# EAGLE board Replicape_B4 (EAGLE 7.7.0), part 1 of 2
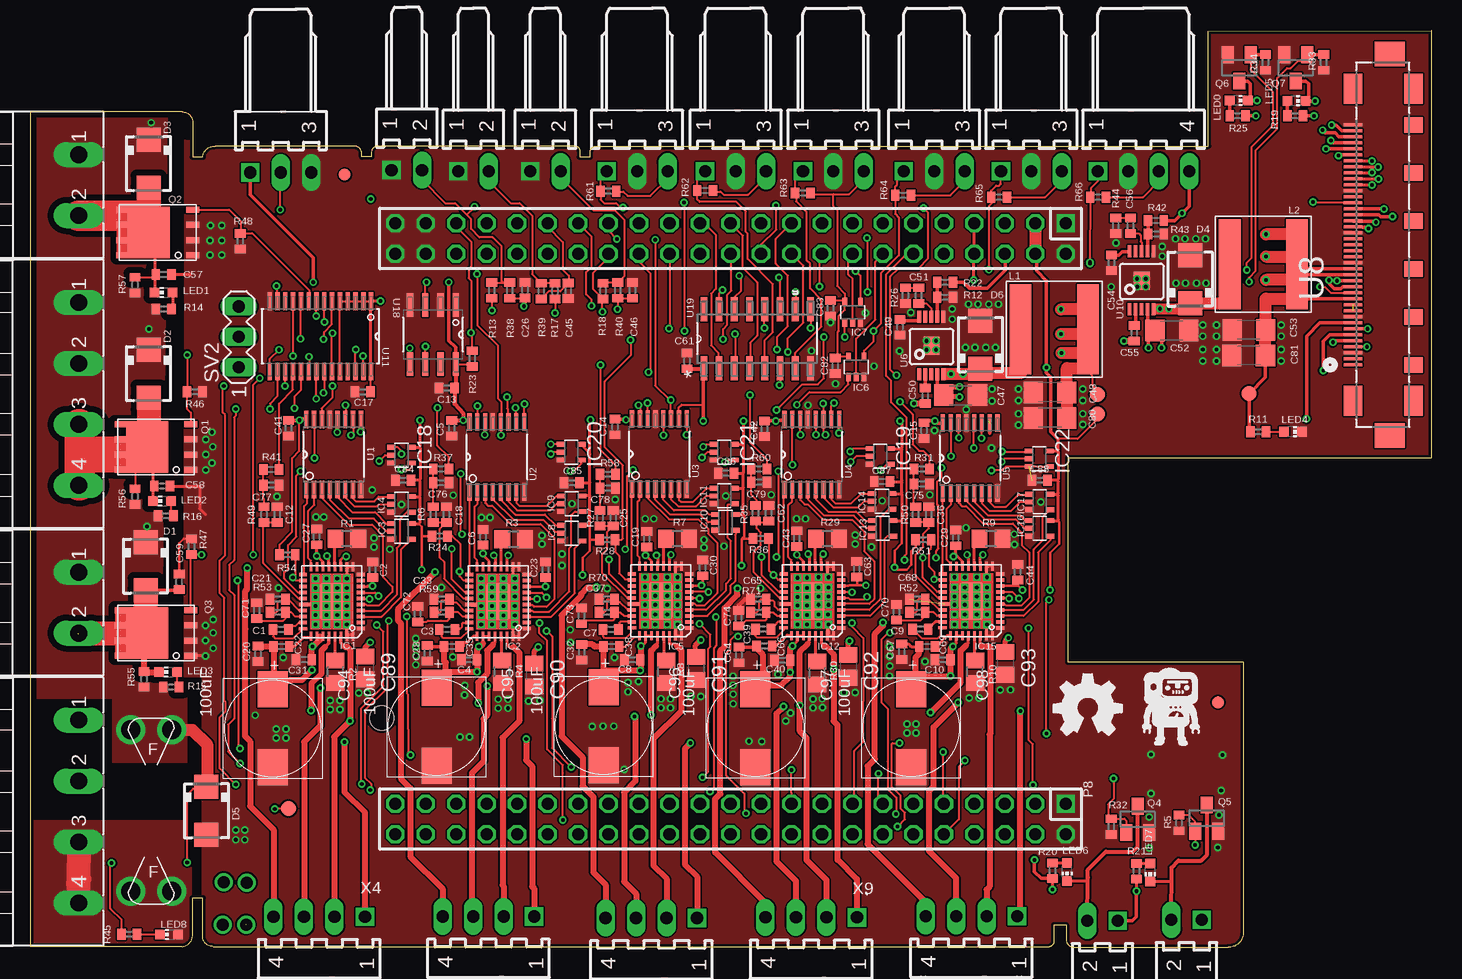
[diagram p3: board, top side]
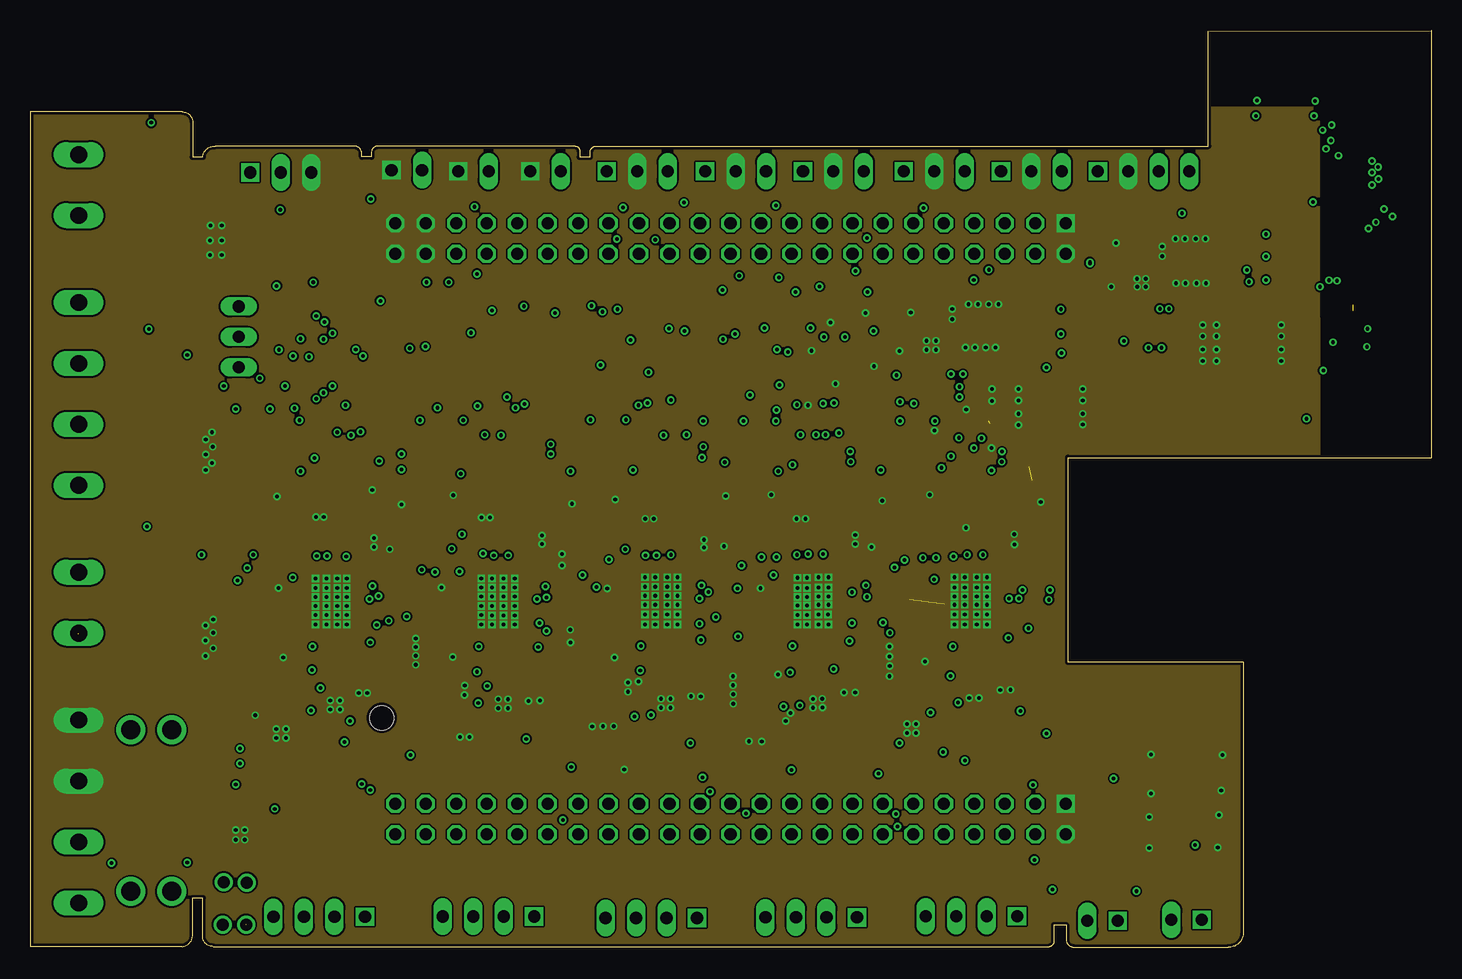
[diagram p4: board, inner layer GND]
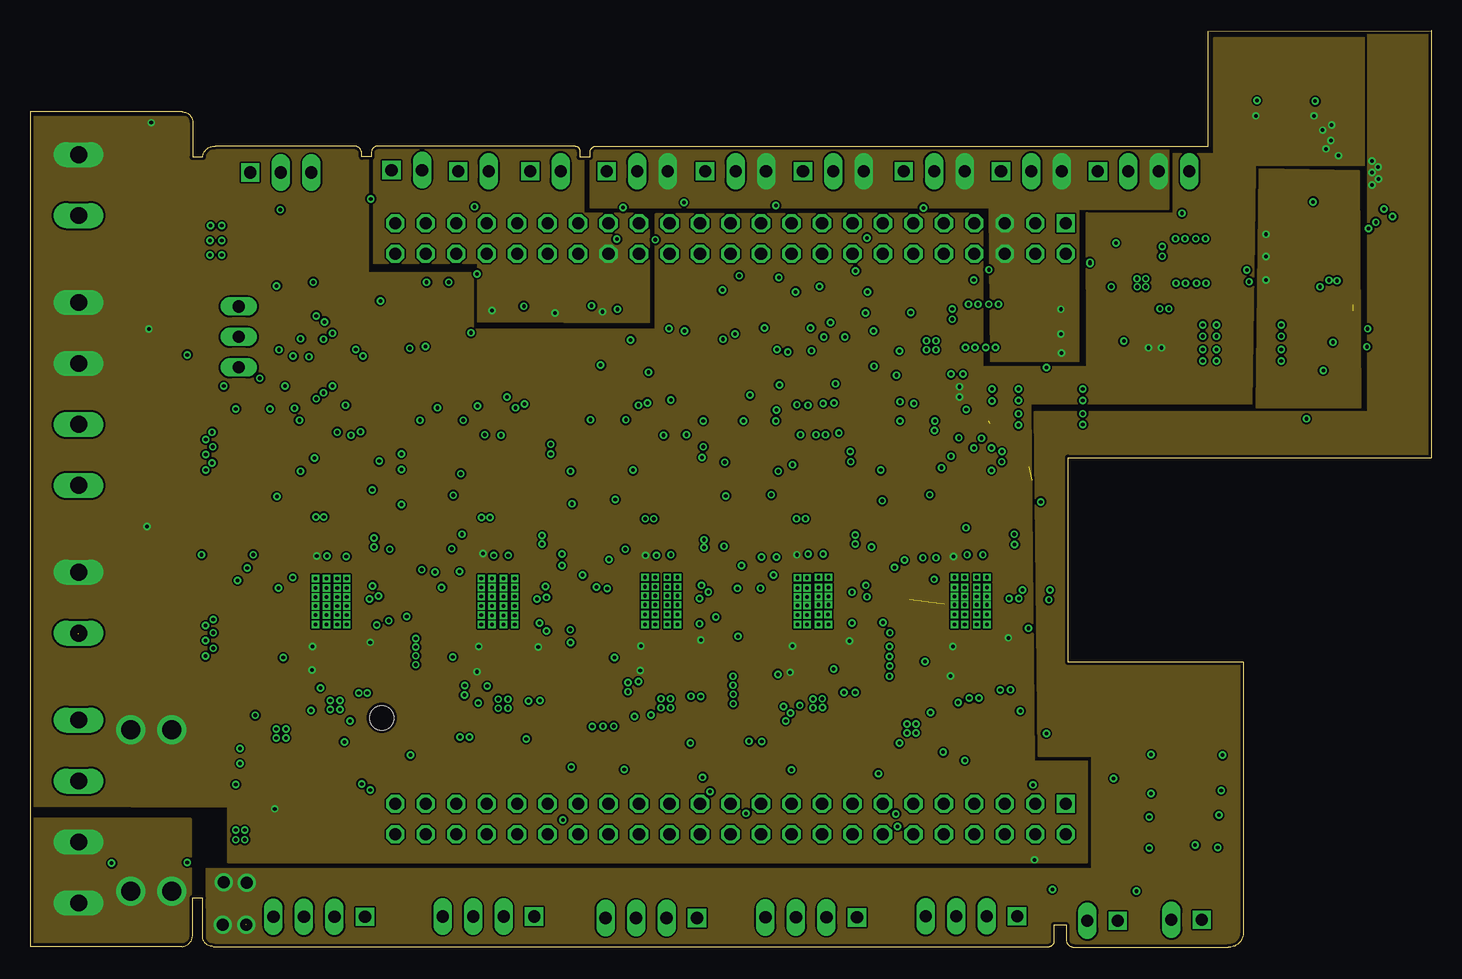
[diagram p5: board, inner layer VCC]
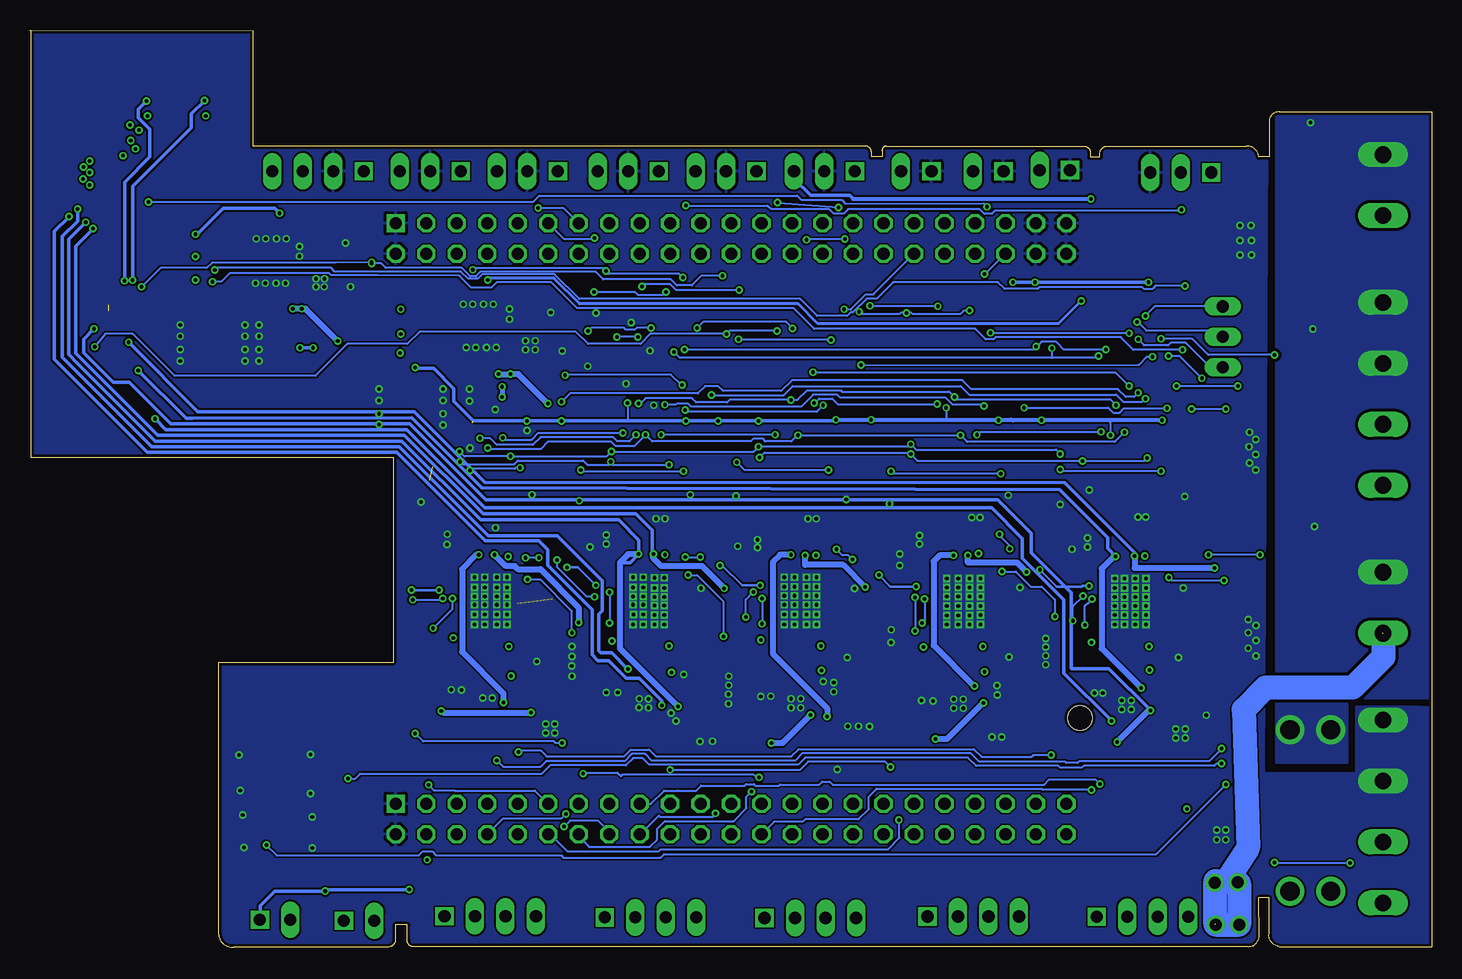
[diagram p6: board, bottom side, seen from below]

Size 116.8 x 76.43 mm. Coordinates in mm from the lower left corner, seen from the top.
Outline: 116.75,76.43 116.75,40.8 86.5,40.8 86.5,23.75 101.1,23.75 101.1,1.1 arc-90 99.85,0 86.95,0 arc-90 86.35,0.65 86.35,1.85 85.35,1.85 85.35,0.6 arc-90 84.95,0.05 15.28,0.05 arc-90 14.38,0.9 14.4,4.1 13.55,4.1 13.55,1.1 arc-90 12.7,0.05 0,0.05 0,69.6 12.7,69.6 arc-90 13.55,68.8 13.55,65.85 14.4,65.85 arc-90 15.45,66.75 27.05,66.75 arc-90 27.65,66.1 27.65,65.85 28.45,65.85 28.45,66.25 arc-90 29,66.75 45.45,66.75 arc-90 45.8,66.35 45.8,65.85 46.67,65.85 46.67,66.2 arc-90 47.17,66.75 98.2,66.75 98.2,76.33 116.8,76.35 116.8,76.4
Copper layers (1*2*3*16): Top 0.035mm / dielectric 0.2mm / GND 0.035mm / dielectric 1.1mm / VCC 0.035mm / dielectric 0.2mm / Bottom 0.035mm
Design rules "default *": minimum track width 0.003809375mm, minimum drill 0.3mm, track to track 6mil, track to pad 6mil, pad to pad 6mil, via to via 6mil, smd to smd 0mil, copper to edge 10mil, drill to drill 10mil, minimum pad ring 10mil, minimum via ring 6mil, stop-mask expansion 2mil, vias tented up to drill 100mil, thermal gap 10mil
Net classes: 1 power: width 1.27 mm
Holes 2 mm at 29.3,19.1

## Footprints (pad centres in the part's own frame; a part is rotated, then mirrored left to right if it is on the bottom)
B1,27 = smd 1.27 x 1.27: TP 0,0
C0402 = smd 0.7 x 0.9: 1 -0.65,0; 2 0.65,0
C1206 = smd 1.6 x 1.8: 1 -1.4,0; 2 1.4,0
C0805 = smd 1.3 x 1.5: 1 -0.95,0; 2 0.95,0
RHS1V10MCN1GS = smd 3 x 2.5: + -3.25,0; - 3.25,0
SMA = smd 2 x 2: A 2,0; C -2,0
3557 = drill 1.6: P$1 -6.73,1.7; P$2 -6.73,-1.7; P$3 6.73,-1.7; P$4 6.73,1.7
QFN36-PAD = smd 0.7 x 0.25: 1 -2.4,2.25; 2 -2.4,1.75; 3 -2.4,1.25; 4 -2.4,0.75; 5 -2.4,0.25; 6 -2.4,-0.25; 7 -2.4,-0.75; 8 -2.4,-1.25; 9 -2.4,-1.75; 10 -2.4,-2.25; 19 2.4,-2.25; 20 2.4,-1.75; 21 2.4,-1.25; 22 2.4,-0.75; 23 2.4,-0.25; 25 2.4,0.75; 26 2.4,1.25; 27 2.4,1.75; 28 2.4,2.25 | smd 0.25 x 0.7: 11 -1.75,-2.9; 13 -0.75,-2.9; 14 -0.25,-2.9; 15 0.25,-2.9; 16 0.75,-2.9; 17 1.25,-2.9; 18 1.75,-2.9; 29 1.75,2.9; 30 1.25,2.9; 31 0.75,2.9; 32 0.25,2.9; 33 -0.25,2.9; 34 -0.75,2.9; 36 -1.75,2.9 | smd 0.25 x 1: 12 -1.25,-2.75; 35 -1.25,2.75 | smd 1 x 0.25: 24 2.25,0.25 | smd 2 x 3: TP 0,0
SC70-5 = smd 0.4 x 0.7: 1 -0.65,-0.85; 2 0,-0.85; 3 0.65,-0.85; 4 0.65,0.85; 5 -0.65,0.85
FIDUCIAL-1X2.5 = smd 1 x 1: 1 0,0
NR8040T330 = smd 1.8 x 7.5: P$1 2.8,0; P$2 -2.8,0
CHIP-LED0603 = smd 0.8 x 0.8: A 0,-0.75; C 0,0.75
DIL-100-2X23 = drill 1.016 square: 1 -27.94,-1.27 | drill 1.016 octagon: 2 -27.94,1.27; 3 -25.4,-1.27; 4 -25.4,1.27; 5 -22.86,-1.27; 6 -22.86,1.27; 7 -20.32,-1.27; 8 -20.32,1.27; 9 -17.78,-1.27; 10 -17.78,1.27; 11 -15.24,-1.27; 12 -15.24,1.27; 13 -12.7,-1.27; 14 -12.7,1.27; 15 -10.16,-1.27; 16 -10.16,1.27; 17 -7.62,-1.27; 18 -7.62,1.27; 19 -5.08,-1.27; 20 -5.08,1.27; 21 -2.54,-1.27; 22 -2.54,1.27; 23 0,-1.27; 24 0,1.27; 25 2.54,-1.27; 26 2.54,1.27; 27 5.08,-1.27; 28 5.08,1.27; 29 7.62,-1.27; 30 7.62,1.27; 31 10.16,-1.27; 32 10.16,1.27; 33 12.7,-1.27; 34 12.7,1.27; 35 15.24,-1.27; 36 15.24,1.27; 37 17.78,-1.27; 38 17.78,1.27; 39 20.32,-1.27; 40 20.32,1.27; 41 22.86,-1.27; 42 22.86,1.27; 43 25.4,-1.27; 44 25.4,1.27; 45 27.94,-1.27; 46 27.94,1.27
8-DFN-EP-(5X6) = smd 1.1 x 0.5: 1 -2.9,1.905; 2 -2.9,0.635; 3 -2.9,-0.635; 4 -2.9,-1.905; 5 2.9,-1.905; 6 2.9,-0.635; 7 2.9,0.635; 8 2.9,1.905 | smd 3.5 x 4.3: TH 0.75,0
SOT23 = smd 1 x 1.4: 1 -0.95,-1.1; 2 0.95,-1.1; 3 0,1.1
R0805 = smd 1.3 x 1.5: 1 -0.95,0; 2 0.95,0
R0402 = smd 0.7 x 0.9: 1 -0.65,0; 2 0.65,0
MA03-1 = drill 1.016 long: 1 -2.54,0; 2 0,0; 3 2.54,0
SOP65P640X120-16N = smd 1.473 x 0.356: 1 -2.921,2.286; 2 -2.921,1.626; 3 -2.921,0.965; 4 -2.921,0.33; 5 -2.921,-0.33; 6 -2.921,-0.965; 7 -2.921,-1.626; 8 -2.921,-2.286; 9 2.921,-2.286; 10 2.921,-1.626; 11 2.921,-0.965; 12 2.921,-0.33; 13 2.921,0.33; 14 2.921,0.965; 15 2.921,1.626; 16 2.921,2.286
MSOP10 = smd 0.3 x 1: 1 -1,-2.4; 2 -0.5,-2.4; 3 0.005,-2.4; 4 0.5,-2.4; 5 1,-2.4; 6 1,2.4; 7 0.5,2.4; 8 0.005,2.4; 9 -0.5,2.4; 10 -1,2.4 | smd 1.3 x 1.5: EP 0.02,-0.04
JAE_FI-RE41S-HF = smd 0.254 x 1.549: 1 0,0; 2 0.508,0; 3 0.991,0; 4 1.499,0; 5 2.007,0; 6 2.489,0; 7 2.997,0; 8 3.505,0; 9 3.988,0; 10 4.496,0; 11 5.004,0; 12 5.512,0; 13 5.994,0; 14 6.502,0; 15 7.01,0; 16 7.493,0; 17 8.001,0; 18 8.509,0; 19 8.992,0; 20 9.5,0; 21 10.008,0; 22 10.49,0; 23 10.998,0; 24 11.506,0; 25 11.989,0; 26 12.497,0; 27 13.005,0; 28 13.487,0; 29 13.995,0; 30 14.503,0; 31 15.011,0; 32 15.494,0; 33 16.002,0; 34 16.51,0; 35 16.993,0; 36 17.501,0; 37 18.009,0; 38 18.491,0; 39 18.999,0; 40 19.507,0; 41 19.99,0 | smd 2.489 x 1.549: 42 -2.997,0; 43 23.012,0; 46 -2.997,-5.029; 47 23.012,-5.029 | smd 2.057 x 2.489: 44 -5.893,-3.073; 45 25.908,-3.073 | smd 1.295 x 1.549: 48 0,-5.029; 49 19.99,-5.029; 50 3.988,-5.029; 51 16.002,-5.029; 52 8.001,-5.029; 53 11.989,-5.029
SOP65P640X110-28N = smd 1.473 x 0.356: 1 -2.921,4.216; 2 -2.921,3.581; 3 -2.921,2.921; 4 -2.921,2.286; 5 -2.921,1.626; 6 -2.921,0.965; 7 -2.921,0.33; 8 -2.921,-0.33; 9 -2.921,-0.965; 10 -2.921,-1.626; 11 -2.921,-2.286; 12 -2.921,-2.921; 13 -2.921,-3.581; 14 -2.921,-4.216; 15 2.921,-4.216; 16 2.921,-3.581; 17 2.921,-2.921; 18 2.921,-2.286; 19 2.921,-1.626; 20 2.921,-0.965; 21 2.921,-0.33; 22 2.921,0.33; 23 2.921,0.965; 24 2.921,1.626; 25 2.921,2.286; 26 2.921,2.921; 27 2.921,3.581; 28 2.921,4.216
SOIC127P600X175-8N = smd 1.981 x 0.533: 1 -2.464,1.905; 2 -2.464,0.635; 3 -2.464,-0.635; 4 -2.464,-1.905; 5 2.464,-1.905; 6 2.464,-0.635; 7 2.464,0.635; 8 2.464,1.905
SOIC127P600X175-16N = smd 1.981 x 0.559: 1 -2.464,4.445; 2 -2.464,3.175; 3 -2.464,1.905; 4 -2.464,0.635; 5 -2.464,-0.635; 6 -2.464,-1.905; 7 -2.464,-3.175; 8 -2.464,-4.445; 9 2.464,-4.445; 10 2.464,-3.175; 11 2.464,-1.905; 12 2.464,-0.635; 13 2.464,0.635; 14 2.464,1.905; 15 2.464,3.175; 16 2.464,4.445
7395-03 = drill 1.016 square: 1 2.54,0 | drill 1.016 long: 2 0,0; 3 -2.54,0
MSTBA4 = drill 1.397 long: 1 -7.62,5.08; 2 -2.54,5.08; 3 2.54,5.08; 4 7.62,5.08
MSTBA2 = drill 1.397 long: 1 -2.54,5.08; 2 2.54,5.08
7395-04 = drill 1.016 square: 1 3.81,0 | drill 1.016 long: 2 1.27,0; 3 -1.27,0; 4 -3.81,0
7395-02 = drill 1.016 square: 1 1.27,0 | drill 1.016 long: 2 -1.27,0

## Placement (x,y rotation side)
3.3V  TPB1,27  [B1,27]  88.95,44.43 0 top
5V  TPB1,27  [B1,27]  88.95,46.05 270 top
12..24V  TPB1,27  [B1,27]  21.55,11.55 90 top
12V  TPB1,27  [B1,27]  101.6,46.13 90 top
C1  22nF  [C0402]  20.89,26.48 0 top
C2  0.1uF  [C0402]  28.55,31.45 90 top
C3  22nF  [C0402]  34.75,26.48 0 top
C4  0.1uF  [C0402]  36.6,23.95 180 top
C5  0.1uF  [C0402]  35.15,43.25 270 top
C6  0.1uF  [C0402]  37.75,34.15 90 top
C7  22nF  [C0402]  48.4,26.48 0 top
C8  0.1uF  [C0402]  50.2,23.95 180 top
C9  22nF  [C0402]  74.2,26.5 0 top
C10  0.1uF  [C0402]  76.05,23.95 180 top
C12  4.7uF  [C0402]  20.6,36.05 90 top
C13  0.1uF  [C0402]  34.73,46.6 180 top
C14  0.1uF  [C0402]  48.75,43.35 270 top
C15  0.1uF  [C0402]  74.5,43.05 270 top
C17  0.1uF  [C0402]  27.73,46.27 180 top
C18  4.7uF  [C0402]  34.7,36.05 90 top
C19  0.1uF  [C0402]  51.4,34 90 top
C20  0.1uF  [C0402]  19,24.45 90 top
C21  4.7uF  [C0402]  20.65,29 0 top
C22  0.1uF  [C0402]  20.95,25.05 180 top
C23  0.1uF  [C0402]  42.95,31.45 90 top
C25  4.7uF  [C0402]  48.6,35.75 90 top
C26  4.7uF  [C0402]  41.25,54.75 90 top
C27  0.1uF  [C0402]  23.89,34.18 90 top
C28  0.1uF  [C0402]  33.1,24.5 90 top
C29  0.1uF  [C0402]  77.15,34.1 90 top
C30  0.1uF  [C0402]  56.05,31.6 90 top
C31  0.1uF  [C0402]  22.83,23.96 180 top
C32  0.1uF  [C0402]  45.98,24.58 90 top
C33  4.7uF  [C0402]  34.3,29 0 top
C35  0.1uF  [C0402]  35.15,25.05 180 top
C36  4.7uF  [C0402]  74.9,36.05 90 top
C37  4.7uF  [C0402]  48.05,29 0 top
C38  0.1uF  [C0402]  48.45,25.05 180 top
C39  22nF  [C0402]  61.1,26.5 0 top
C40  0.1uF  [C0402]  62.7,23.9 180 top
C41  0.1uF  [C0402]  21.55,43.25 270 top
C42  0.1uF  [C0402]  61.2,43.2 270 top
C43  0.1uF  [C0402]  63.9,34.05 90 top
C44  0.1uF  [C0402]  82.3,31.25 90 top
C45  4.7uF  [C0402]  44.85,54.7 270 top
C46  4.7uF  [C0402]  50.2,54.73 90 top
C47  10uF  [C1206]  77.55,46 0 top
C48  10uF  [C1206]  85,46.23 180 top
C49  10nF  [C0402]  72.5,51.65 270 top
C50  10nF  [C0402]  74.6,45.95 270 top
C51  1nF  [C0402]  74.05,54.3 90 top
C52  10uF  [C1206]  95.15,51.4 0 top
C53  10uF  [C1206]  101.58,51.43 180 top
C54  10nF  [C0402]  90.12,57.03 270 top
C55  10nF  [C0402]  92.03,51.15 270 top
C56  1nF  [C0402]  91.7,60.13 90 top
C57  4.7nF  [C0402]  11.12,56.05 0 top
C58  4.7nF  [C0402]  11,38.43 0 top
C59  4.7nF  [C0402]  12.43,30.45 90 top
C61  0.1uF  [C0402]  54.75,48.85 90 top
C62  4.7uF  [C0402]  61.55,36.15 90 top
C63  0.1uF  [C0402]  68.9,31.5 90 top
C64  0.1uF  [C0402]  59.08,24.35 90 top
C65  4.7uF  [C0402]  60.7,29 0 top
C66  0.1uF  [C0402]  61.2,25.1 180 top
C67  0.1uF  [C0402]  72.65,24.63 90 top
C68  4.7uF  [C0402]  73.95,29 0 top
C69  0.1uF  [C0402]  74.75,25.05 180 top
C70  0.1uF  [C0402]  72.2,27.9 90 top
C71  0.1uF  [C0402]  18.9,28.05 90 top
C72  0.1uF  [C0402]  32.3,27.75 90 top
C73  0.1uF  [C0402]  45.95,27.6 90 top
C74  0.1uF  [C0402]  59.05,27.4 90 top
C75  4.7uF  [C0402]  74.3,38.6 0 top
C76  4.7uF  [C0402]  34.25,38.7 0 top
C77  4.7uF  [C0402]  20.1,38.5 0 top
C78  4.7uF  [C0402]  48.15,38.25 0 top
C79  4.7uF  [C0402]  60.75,38.75 0 top
C80  10uF  [C1206]  85,44.1 180 top
C81  10uF  [C1206]  101.55,49.3 180 top
C82  0.1uF  [C0402]  67.1,48.45 270 top
C83  0.1uF  [C0402]  66.7,53.25 270 top
C84  0.1uF  [C0402]  31.1,38.9 180 top
C85  0.1uF  [C0402]  45.15,38.7 180 top
C86  0.1uF  [C0402]  58,39.5 180 top
C87  0.1uF  [C0402]  71,38.8 180 top
C88  0.1uF  [C0402]  84.15,38.9 180 top
C89  10uF  [C0805]  27.93,23.28 270 top
C90  10uF  [C0805]  42.02,22.68 270 top
C91  10uF  [C0805]  55.5,23.23 270 top
C92  10uF  [C0805]  68.17,23.4 270 top
C93  10uF  [C0805]  81.28,23.65 270 top
C94  100uF  [RHS1V10MCN1GS]  20.23,18.23 270 top
C95  100uF  [RHS1V10MCN1GS]  33.88,18.35 270 top
C96  100uF  [RHS1V10MCN1GS]  47.8,18.4 270 top
C97  100uF  [RHS1V10MCN1GS]  60.45,18.25 270 top
C98  100uF  [RHS1V10MCN1GS]  73.42,18.25 270 top
D1  MBRA340T3  [SMA]  9.62,31.75 270 top
D2  MBRA340T3  [SMA]  9.88,47.8 270 top
D3  MBRA340T3  [SMA]  9.88,65.3 270 top
D4  MBRA340T3  [SMA]  96.67,55.68 90 top
D5  MBRA340T3  [SMA]  14.7,11.35 270 top
D6  MBRA340T3  [SMA]  79.2,50.2 90 top
F1  FUSE  [3557]  10.1,11.38 90 top
FH1  FUSE-HOLDER  [FUSE-HOLDER]  9.85,5.8 0 top
FH2  FUSE-HOLDER  [FUSE-HOLDER]  9.8,16.03 0 top
IC1  TMC2100-LA  [QFN36-PAD]  25.15,28.8 180 top
IC2  TMC2100-LA  [QFN36-PAD]  39,28.8 180 top
IC3  74AHC1G126DCK  [SC70-5]  30.95,34.65 270 top
IC4  74AHC1G126DCK  [SC70-5]  30.95,36.9 270 top
IC5  TMC2100-LA  [QFN36-PAD]  52.55,28.85 180 top
IC6  74AHC1G126DCK  [SC70-5]  68.85,48.35 0 top
IC7  74AHC1G126DCK  [SC70-5]  68.55,52.9 0 top
IC8  74AHC1G126DCK  [SC70-5]  45.15,34.5 270 top
IC9  74AHC1G126DCK  [SC70-5]  45.15,36.95 270 top
IC10  74AHC1G126DCK  [SC70-5]  57.95,35.4 270 top
IC11  74AHC1G126DCK  [SC70-5]  57.85,37.6 270 top
IC12  TMC2100-LA  [QFN36-PAD]  65.2,28.85 180 top
IC13  74AHC1G126DCK  [SC70-5]  71.05,34.9 270 top
IC14  74AHC1G126DCK  [SC70-5]  71,37.15 270 top
IC15  TMC2100-LA  [QFN36-PAD]  78.45,28.85 180 top
IC16  74AHC1G126DCK  [SC70-5]  84.15,34.9 270 top
IC17  74AHC1G126DCK  [SC70-5]  84.15,37.1 270 top
IC18  74AHC1G126DCK  [SC70-5]  30.95,41 270 top
IC19  74AHC1G126DCK  [SC70-5]  70.85,40.9 270 top
IC20  74AHC1G126DCK  [SC70-5]  45.1,41.25 270 top
IC21  74AHC1G126DCK  [SC70-5]  57.85,41.25 270 top
IC22  74AHC1G126DCK  [SC70-5]  84.1,40.7 270 top
JP1  FIDUCIAL1X2.5  [FIDUCIAL-1X2.5]  26.23,64.38 0 top
JP2  FIDUCIAL1X2.5  [FIDUCIAL-1X2.5]  99,20.4 0 top
L1  33uH  [NR8040T330]  85.35,51.48 0 top
L2  33uH  [NR8040T330]  102.78,56.9 0 top
LED0  blue  [CHIP-LED0603]  100.72,70.55 270 top
LED1  blue  [CHIP-LED0603]  11.12,54.55 90 top
LED2  blue  [CHIP-LED0603]  11,37.18 90 top
LED3  blue  [CHIP-LED0603]  11.5,22.93 90 top
LED4  blue  [CHIP-LED0603]  105.25,42.95 270 top
LED5  blue  [CHIP-LED0603]  105.53,70.53 270 top
LED6  blue  [CHIP-LED0603]  86.42,6.28 180 top
LED7  blue  [CHIP-LED0603]  93.35,6.23 180 top
LED8  blue  [CHIP-LED0603]  11.57,1.05 90 top
LOGO1  OSHW_LOGO_FILLX0200-NT  [OSHW_FILLX200_NOTEXT]  85.31,17.66 0 top
P8  F-2X23-  [DIL-100-2X23]  58.38,10.68 180 top
P9  F-2X23-  [DIL-100-2X23]  58.38,59.05 180 top
Q1  AON6758  [8-DFN-EP-(5X6)]  10.5,41.68 180 top
Q2  AON6758  [8-DFN-EP-(5X6)]  10.65,59.55 180 top
Q3  AON6758  [8-DFN-EP-(5X6)]  10.5,26.18 180 top
Q4  [SOT23]  92.3,10.65 0 top
Q5  [SOT23]  98.05,10.75 0 top
Q6  [SOT23]  100.78,73.28 180 top
Q7  [SOT23]  105.47,73.28 180 top
R1  0.1R  [R0805]  26.4,34.03 180 top
R2  0.1R  [R0805]  25.45,22.95 90 top
R3  0.1R  [R0805]  40.3,33.98 180 top
R4  0.1R  [R0805]  39.35,22.95 90 top
R5  4.7K  [R0402]  95.75,10.35 90 top
R6  10K  [R0402]  33.6,36.05 90 top
R7  0.1R  [R0805]  53.95,34.03 180 top
R8  0.1R  [R0805]  53,22.95 90 top
R9  0.1R  [R0805]  80.08,34.03 180 top
R10  0.1R  [R0805]  78.75,22.95 90 top
R11  4.7K  [R0402]  102.35,42.95 180 top
R12  44.3K,1%  [R0402]  76.25,55.4 180 top
R13  4K7, 1%  [R0402]  38.48,54.73 270 top
R14  4.7K  [R0402]  11.12,53.18 180 top
R15  4.7K  [R0402]  11.75,21.68 180 top
R16  4.7K  [R0402]  11.3,35.95 180 top
R17  4K7, 1%  [R0402]  43.75,54.68 270 top
R18  4K7, 1%  [R0402]  47.75,54.68 270 top
R19  4.7K  [R0402]  105.42,69.28 0 top
R20  4.7K  [R0402]  85.2,6.38 270 top
R21  4.7K  [R0402]  92.2,6.33 270 top
R22  10K,1%  [R0402]  76.25,54.15 0 top
R23  4.7K  [R0402]  36.85,49.05 270 top
R24  4.7K  [R0402]  34.15,34.25 180 top
R25  4.7K  [R0402]  100.62,69.28 0 top
R26  39K  [R0402]  72.95,54.3 270 top
R27  10K  [R0402]  47.5,35.75 90 top
R28  4.7K  [R0402]  48.1,33.95 180 top
R29  0.1R  [R0805]  66.45,34.03 180 top
R30  0.1R  [R0805]  65.6,22.85 90 top
R31  10K  [R0402]  74.3,39.85 0 top
R32  4.7K  [R0402]  90.1,10.05 90 top
R33  4.7K  [R0402]  107.8,73.73 90 top
R34  4.7K  [R0402]  102.95,73.73 90 top
R35  10K  [R0402]  60.45,36.15 90 top
R36  4.7K  [R0402]  60.9,34.05 180 top
R37  10K  [R0402]  34.25,39.85 0 top
R38  10K  [R0402]  39.98,54.73 270 top
R39  10K  [R0402]  42.6,54.68 270 top
R40  10K  [R0402]  48.98,54.73 270 top
R41  10K  [R0402]  20.1,39.8 0 top
R42  120K,1%  [R0402]  93.83,60.55 180 top
R43  10K,1%  [R0402]  93.83,59.43 0 top
R44  39K  [R0402]  90.47,60.13 270 top
R45  4.7K  [R0402]  8.28,1.08 0 top
R46  4.7K  [R0402]  13.72,46.28 180 top
R47  4.7K  [R0402]  13.45,33.38 270 top
R48  4.7K  [R0402]  17.52,58.83 90 top
R49  10K  [R0402]  19.5,36.05 90 top
R50  10K  [R0402]  73.8,36.05 90 top
R51  4.7K  [R0402]  74.45,33.95 180 top
R52  2.2R  [R0402]  73.95,27.9 0 top
R53  2.2R  [R0402]  20.65,27.9 0 top
R54  4.7K  [R0402]  21.45,32.7 180 top
R55  4.7K  [R0402]  9.5,22.33 270 top
R56  4.7K  [R0402]  8.75,37.55 270 top
R57  4.7K  [R0402]  8.75,55.18 270 top
R58  10K  [R0402]  48.15,39.4 0 top
R59  2.2R  [R0402]  34.3,27.9 0 top
R60  10K  [R0402]  60.75,39.85 0 top
R61  4.7K  [R0402]  48.2,63 0 top
R62  4.7K  [R0402]  56.25,63.05 0 top
R63  4.7K  [R0402]  64.4,62.85 0 top
R64  4.7K  [R0402]  72.75,62.65 0 top
R65  4.7K  [R0402]  80.75,62.5 0 top
R66  4.7K  [R0402]  89,62.5 0 top
R70  2.2R  [R0402]  48.05,27.9 0 top
R71  2.2R  [R0402]  60.7,27.9 0 top
SV2  [MA03-1]  17.4,50.85 90 top
U1  SN74AHC595PW  [SOP65P640X120-16N]  25.3,41.05 90 top
U2  SN74AHC595PW  [SOP65P640X120-16N]  38.9,40.85 90 top
U3  SN74AHC595PW  [SOP65P640X120-16N]  52.45,41.1 90 top
U4  SN74AHC595PW  [SOP65P640X120-16N]  65.15,41.05 90 top
U5  SN74AHC595PW  [SOP65P640X120-16N]  78.35,40.75 90 top
U6  RT8268  [MSOP10]  75.1,50.15 0 top
U8  FI-RE41S-HFRIGHT_ANGLE  [JAE_FI-RE41S-HF]  110.25,48.53 90 top
U10  RT8268  [MSOP10]  92.62,55.58 0 top
U11  PCA9685PW  [SOP65P640X110-28N]  24.2,50.9 270 top
U18  CAT24C256  [SOIC127P600X175-8N]  33.58,51.05 270 top
U19  CD4050BD  [SOIC127P600X175-16N]  60.6,50.7 90 top
U$1  [LOGO_BIG]  94.65,20.1 0 top
U$4  CC-BY-SA  [CC-BY-SA]  23.75,58.7 0 top
X1  22-05-7038-03  [7395-03]  58.8,64.65 180 top
X2  MSTBA4  [MSTBA4]  -1.02,11.3 270 top
X3  MSTBA2  [MSTBA2]  -1.02,28.7 270 top
X4  22-05-7048-04  [7395-04]  24.1,2.53 0 top
X5  22-05-7028-02  [7395-02]  89.38,2.2 0 top
X6  22-05-7028-02  [7395-02]  96.38,2.28 0 top
X7  22-05-7028-02  [7395-02]  36.95,64.65 180 top
X8  22-05-7028-02  [7395-02]  31.4,64.75 180 top
X9  22-05-7048-04  [7395-04]  65.1,2.48 0 top
X10  22-05-7038-03  [7395-03]  75.35,64.65 180 top
X11  22-05-7028-02  [7395-02]  42.95,64.65 180 top
X12  22-05-7048-04  [7395-04]  92.8,64.65 180 top
X13  22-05-7038-03  [7395-03]  66.95,64.65 180 top
X15  22-05-7048-04  [7395-04]  38.2,2.55 0 top
X16  22-05-7048-04  [7395-04]  51.77,2.43 0 top
X18  22-05-7048-04  [7395-04]  78.45,2.58 0 top
X19  22-05-7038-03  [7395-03]  83.45,64.65 180 top
X20  MSTBA4  [MSTBA4]  -1.02,46.1 270 top
X21  MSTBA2  [MSTBA2]  -1.02,63.5 270 top
X22  22-05-7038-03  [7395-03]  50.6,64.65 180 top
X23  22-05-7038-03  [7395-03]  20.9,64.55 180 top
XC1  MSTBA4-CONNECTOR  [MSTBA4-CONNECTOR]  -7.62,11.28 90 top  (outside the outline)
XC2  MSTBA4-CONNECTOR  [MSTBA4-CONNECTOR]  -7.65,46.05 90 top  (outside the outline)
XC3  MSTBV2-CONNECTOR  [MSTBA2-CONNECTOR]  -7.65,28.65 90 top  (outside the outline)
XC4  MSTBV2-CONNECTOR  [MSTBA2-CONNECTOR]  -7.62,63.5 90 top  (outside the outline)

## Tracks (layer width: path | path; a pad name or v marks a point on that pad's centre or on a via)
+3V3  (via drill 0.3)  (1 unrouted)
  Top 0.152: 83.75,60.18 83.78,60.2 P9.3 | P9.4 83.88,57.68 | U18.8 36.66,48.59 R23.2 | IC3.5 31.95,35.25 | 31.95,37.55 IC4.5 | 68.95,30.8 C63.1 | 50.11,43.97 U3.16 | 22.4,43.85 v22.45,43.9 22.45,41.35 21.85,40.75 21.85,34.6 20.8,33.55 R54.2 | C42.1 61.3,43.85 61.35,43.9 | U4.16 62.79,43.9 62.79,43.86 62.8,43.85 | 82.3,30.1 82.35,30.1 | 36.15,43.85 v36.1,43.9 | 55.95,30.1 v55.95,30.15 | 32.7,34.25 32.65,34.3 | U3.10 54.08,44.98 54.3,45.2 56.02,45.2 56.12,45.3 | U2.10 40.53,44.88 v40.45,44.95 | U1.10 26.93,42.83 v26.75,42.65 | U18.3 32.94,55.29 v33.05,55.4 | U4.10 66.78,45.13 v67,45.35 | IC10.5 59.1,36.05 | 3.3V.TP 88.95,44 87.3,42.35 85.65,42.35
  Top 0.2: IC2.8 v42.95,30.05 C23.1 | v46.05,31 46.05,32.45 46.65,33.05 46.65,34.05 | 46.65,34.05 46.65,35.15 | IC12.8 68.2,30.1 68.25,30.15 68.95,30.15 | IC15.8 82.3,30.1 C44.1 | 82.35,30.1 v82.7,29.75 | v85,29.75 85,32.85 85.75,33.6 85.75,35.4 85.6,35.55 | v32.65,31.45 32.65,34.3 32.65,35.05 32.4,35.3 | v59.3,31.8 59.3,34 59.35,34.05 | IC5.8 55.95,30.1 | C30.1 56.05,30.25 v55.95,30.15 | R36.2 59.35,34.05 | R28.2 46.75,33.95 46.65,34.05 | R24.2 32.7,34.25 | 72.65,35.55 72.65,33.65 72.05,33.05 v72.05,31.65 72.25,31.45 73.05,31.45 73.45,31.85 73.45,33 73.8,33.35 R51.2 | IC1.8 28.1,30.05 28.15,30.1 v28.55,30.1 C2.1 | 68.95,30.15 v69.65,30.15 | 68.95,30.8 68.95,30.15 | 59.4,36.05 59.5,35.95 59.5,34.15 59.45,34.1 59.4,34.1 59.35,34.05
  Top 0.25: IC8.5 46.65,35.15 46.65,37.6 | 46.65,37.6 IC9.5 | 46.65,37.6 46.65,38.7 | 46.65,38.7 46.65,41.1 | 46.65,41.1 46.65,43.85 v46.7,43.95 | IC16.5 85.6,35.55 85.7,35.65 85.7,37.65 85.6,37.75 | IC17.5 85.6,37.75 | 85.6,37.75 85.7,37.85 85.7,38.8 85.6,38.9 | 31.95,39.05 31.8,38.9 C84.1 32.4,38.9 | C85.1 46.65,38.7 | v72.5,43.85 72.65,43.7 72.65,41.65 72.55,41.55 | 72.55,37.8 72.65,37.7 72.65,35.55 IC13.5 | C86.1 59.45,39.5 | 59.1,36.05 59.4,36.05 59.45,36.05 59.45,38.3 | 59.45,38.3 59.45,39.5 | IC11.5 59.4,38.25 59.45,38.3 | 85.6,38.9 C88.1 | IC22.5 85.6,41.35 | 85.6,41.35 85.7,41.25 85.7,39 85.6,38.9 | 85.6,41.35 85.7,41.45 85.7,42.3 85.65,42.35 | IC3.5 32.4,35.3 32.5,35.4 32.5,37.45 32.4,37.55 | IC4.5 32.4,37.55 | 32.4,37.55 32.5,37.65 32.5,38.8 32.4,38.9 | 32.45,41.65 32.5,41.6 32.5,39 32.4,38.9 | IC18.5 32.45,41.65 | 32.45,41.65 32.5,41.75 v32.5,43.9 | IC19.5 72.55,41.55 | 72.55,41.55 72.65,41.45 72.65,38.9 72.55,38.8 | C87.1 72.55,38.8 | IC14.5 72.55,37.8 | 72.55,37.8 72.65,37.9 72.65,38.7 72.55,38.8 | v59.45,43.85 59.45,41.95 | 59.45,41.95 59.45,39.5 | IC21.5 59.4,41.9 59.45,41.95 | IC20.5 46.65,41.1
  Top 0.3: U18.8 35.48,49.97 34.9,50.55 v34.9,55.4 | U5.16 75.58,43.67 v75.4,43.85 74.65,43.85 | v23.6,55.4 23.6,57.45 18.35,62.7 X23.1 | 48.78,43.97 49.58,43.97 49.6,43.95 v49.65,43.95 50.09,43.95 U3.16 | 56.12,48.2 56.12,45.3 56.12,43.88 v56.1,43.85 | C42.1 v62.15,43.85 62.2,43.9 62.79,43.9 | U5.10 79.98,42.83 | 83.88,57.13 83.88,56.38 84.7,55.55 v84.7,48.3 84.7,47.85 85.05,47.5 85.05,42.95 85.65,42.35
  Top 0.35: C41.1 v22.45,43.9 22.52,43.97 U1.16 | U18.8 35.48,46.86 C13.1 35.38,45.28 36.1,44.5 v36.1,43.9 | 83.88,57.68 83.88,57.13 | C61.1 56.12,48.2 | 74.65,43.85 C15.1 | v36.1,43.9 36.48,43.9 U2.16 | C5.1 v36.1,43.9 | 48.78,43.97 C14.1
  Top 0.406: 83.88,57.68 84.17,57.68
  Top 0.53: 56.12,48.2 U19.1
  Top 1: 83.75,60.18 83.78,60.15 P9.4
  Bottom 0.152: v49.65,43.95 49.62,43.95 | v40.45,44.95 40.45,44 40.4,43.95 | v26.75,42.65 26.75,43.8 26.85,43.9 | v67,45.35 67,43.95 67.1,43.85
  Bottom 0.2: v32.65,31.45 31.25,30.05 29.15,30.05 29.1,30.1 v28.55,30.1 | v42.95,30.05 45.1,30.05 v46.05,31 | v82.7,29.75 v85,29.75 | v55.95,30.15 57.45,30.15 59.1,31.8 v59.3,31.8 | v69.65,30.15 71.15,31.65 v72.05,31.65
  Bottom 0.3: v34.9,55.4 v33.05,55.4 v23.6,55.4 | v49.65,43.95 49.75,43.85 v56.1,43.85 v59.45,43.85 v62.15,43.85 67.1,43.85 v72.5,43.85 v75.4,43.85 79.85,43.85 81.47,45.48 81.47,46.55 83.15,48.23 84.62,48.23 v84.7,48.3
  Bottom 0.35: v49.65,43.95 v46.7,43.95 40.4,43.95 35.05,43.95 v36.1,43.9 | v22.45,43.9 26.85,43.9 v32.5,43.9 v36.1,43.9 | 34.9,43.9 v36.1,43.9
AUX_0  (1 unrouted)
DALLAS_W1  (via drill 0.3)
  Top 0.152: P9.22 60.91,58.52 62.2,59.8 62.2,61.75 v62.15,61.8 | v20.85,61.45 20.85,64.5 X23.2
  Bottom 0.15: 20.95,61.35 36.4,61.35 36.65,61.1 37.27,61.1 37.67,61.5 48.62,61.5 49,61.13 49.83,61.13 50.2,61.5 55.05,61.5 55.26,61.71
  Bottom 0.152: v62.15,61.8 55.35,61.8 55.26,61.71 | 20.95,61.35 v20.85,61.45
DIR_E  (via drill 0.3)
  Top 0.15: P8.15 68.7,12.11 68.7,16.35 69.45,17.1 69.45,20.5
  Top 0.152: IC12.7 68.1,29.6 68.12,29.58 v68.5,29.58 | v68.5,27 68.5,26.7 69.45,25.75 69.45,20.5
  Bottom 0.152: v68.5,29.58 v68.5,27
DIR_H  (via drill 0.3)
  Top 0.152: IC15.7 81.85,29.6 v82.4,29.05 | v72.45,17 71.88,17 71.8,16.93 71.8,13.35 72.55,12.6 72.55,11.55 72.9,11.2 72.9,10.65 v72.3,10.05 | v84.7,17.8 84.7,28.75 v84.9,28.95
  Bottom 0.152: P8.16 68.53,9.64 69.45,10.55 71.8,10.55 v72.3,10.05 72.3,10.1 | v72.45,17 72.97,17 73.12,17.15 84.05,17.15 v84.7,17.8 | v84.9,28.95 82.5,28.95 v82.4,29.05
DIR_X  (via drill 0.3)
  Top 0.152: IC1.7 28.75,29.55 v29.05,29.25 | v28.35,13.1 28.43,13.18 28.43,13.6 27.9,14.13 27.9,19.73 29.8,21.63 29.8,27.1 v29.9,27.2
  Bottom 0.152: 55.8,9.41 P8.26 54.79,10.45 52.4,10.45 52.21,10.64 47.76,10.64 46.9,11.5 46.9,12.55 46.25,13.2 32.5,13.2 32.4,13.1 v28.35,13.1 | v29.9,27.2 29.9,28.4 v29.05,29.25
DIR_Y  (via drill 0.3)
  Top 0.15: 43.5,19.05 43.5,16.6 v45.1,15 | 63.45,12.85 v63.45,14.78
  Top 0.152: IC2.7 42.65,29.55 v43.05,29.15 | v43.05,26.35 43.5,25.9 43.5,19.05 | 63.45,12.85 P8.19
  Bottom 0.15: v45.1,15 45.55,15.45 51.95,15.45 | v63.45,14.78 63.42,14.8 52.6,14.8
  Bottom 0.152: v43.05,29.15 v43.05,26.35 | 51.95,15.45 52.6,14.8
DIR_Z  (via drill 0.3)
  Top 0.15: v57.15,27.5 57.23,27.43 57.23,25.15 57,24.93 57,13.28 v56.67,12.95 | v56.52,29.6 IC5.7
  Bottom 0.15: 63.9,10.5 58.17,10.5 57.1,11.58 57.1,12.55 v56.67,12.95 | v57.15,27.5 57.17,28.95 v56.52,29.6
  Bottom 0.152: P8.14 71.08,9.23 70.2,8.35 65.15,8.35 64.55,8.95 64.55,9.85 63.9,10.5
E_A1  (via drill 0.3)
  Top 0.25: IC12.34 65.95,25.3 66.15,25.1
  Top 0.3: U8.27 112.77,61.53 v112.83,61.5
  Top 0.5: 66.15,25.1 66.3,25.1 66.97,24.43 v66.97,23.18 66.97,18.83 67.3,18.5 67.3,7.27 68.91,5.66 X9.1
  Bottom 0.3: v66.97,23.18 68.33,24.53 69.22,24.53 69.4,24.7 69.4,27.73 69.1,28.03 69.1,30.55 72.85,34.3 78.6,34.3 86.03,41.7 106.65,41.7 114.1,49.15 114.1,59.23 112.83,60.5 v112.83,61.5
E_A2  (via drill 0.3)
  Top 0.25: 64.8,25.25 64.95,25.4 IC12.32
  Top 0.3: v113.55,60.88 112.55,60.88 112.38,61.03 U8.26
  Top 0.5: 64.8,25.25 64.15,24.6 v64.15,20.15 64.15,18 64.72,17.43 64.72,7.24 66.37,5.6 X9.2
  Bottom 0.3: v64.15,20.15 64.15,20.53 66.05,22.43 67.12,22.43 68.58,23.88 69.47,23.88 69.95,24.35 69.95,28.13 73.65,31.83 73.65,33.1 74.4,33.85 78.88,33.85 86.25,41.23 107.03,41.23 114.78,48.98 114.78,59.65 v113.55,60.88
E_B1  (via drill 0.3)
  Top 0.25: IC12.13 65.95,32.6 v66.1,32.75
  Top 0.3: U8.25 110.28,60.5 112.05,60.5 v112.15,60.4
  Top 0.5: v62.8,20.05 62.2,19.45 62.2,7.15 63.83,5.52 X9.3
  Bottom 0.3: 67.65,32.05 66.8,32.05 66.08,32.78 66.08,33.93 67.75,35.6 79.25,35.6 85.83,42.18 106.35,42.18 112.85,48.68 113.58,49.4 113.58,59 112.85,59.7 v112.15,60.4
  Bottom 0.5: v66.1,32.75 66.95,32.75 67.65,32.05 67.65,24.9 v62.8,20.05
E_B2  (via drill 0.3)
  Top 0.25: v64.85,32.75 64.95,32.65 IC12.15
  Top 0.3: v111.55,59.88 111.42,60 111.08,60 U8.24
  Top 0.5: v58.95,29.9 58.95,29.35 57.88,28.28 57.88,25.05 57.52,24.7 57.52,12.78 57.1,12.35 57.1,7.9 61.29,3.71 X9.4
  Bottom 0.3: v111.55,59.88 113,58.43 113,49.5 106.17,42.68 105.2,42.68 85.62,42.65 79.05,36.1 66.33,36.1 64.95,34.73 64.95,32.85 v64.85,32.75
  Bottom 0.5: v58.95,29.9 60.8,31.75 64.2,31.75 64.85,32.4 v64.85,32.75
EN_EH  (via drill 0.3)
  Top 0.152: IC22.2 81.22,40.7 v80.97,40.45 | v63.55,40.2 63.5,40.25 63.5,43.95 U4.15 | IC19.2 68.85,40.9 v68.4,40.45
  Bottom 0.152: v80.97,40.45 80.78,40.25 76.45,40.25 76.15,40.55 70.7,40.55 70.35,40.2 68.5,40.2 68.4,40.3 | v63.55,40.2 68.3,40.2 68.4,40.3 | 68.4,40.3 v68.4,40.45
EN_XYZ  (via drill 0.3)
  Top 0.152: v29.1,40.5 29.6,41 IC18.2 | IC20.2 43.55,41.25 v43.4,41.1 | U1.15 23.67,40.78 v23.7,40.75 | IC21.2 56.45,41.25 v56,40.8
  Bottom 0.152: v23.7,40.75 23.95,40.5 v29.1,40.5 29.15,40.55 42.85,40.55 v43.4,41.1 43.5,41.2 55.6,41.2 v56,40.8
ENABLE  (via drill 0.3)
  Top 0.152: P9.41 35.52,60.04 36.75,58.8 36.75,56.7 36.55,56.5 36.55,55.75 36.75,55.55 v36.75,51.2 36.85,51.1 R23.1 | v25.2,51.15 25.16,51.14 U11.23 25.1,48.47
  Bottom 0.152: v25.2,51.15 36.7,51.15 v36.75,51.2
ENABLE_E  (via drill 0.3)
  Top 0.152: IC19.4 71.4,40.25 v70.9,39.75 | v62.35,39.65 62.35,32.65 v62.2,32.5 | v60.95,32.5 60.95,31.05 62.4,29.6 IC12.22
  Bottom 0.152: v70.9,39.75 70.8,39.65 v62.35,39.65 | v62.2,32.5 v60.95,32.5
ENABLE_H  (via drill 0.3)
  Top 0.15: 84.35,40.05 81.35,40.05 81.03,39.73 v80.12,39.73
  Top 0.152: IC15.22 75.6,29.6 74.4,30.8 v74.4,32.45 | v75.5,32.45 75.5,33 75.7,33.2 75.7,36.8 75.6,36.9 75.6,38.8 75.95,39.15 v75.95,39.95 | 84.35,40.05 IC22.4
  Bottom 0.152: v74.4,32.45 v75.5,32.45 | v75.95,39.95 76.3,39.95 76.4,39.85 80,39.85 v80.12,39.73
ENABLE_X  (via drill 0.3)
  Top 0.152: IC1.22 22.35,29.55 21.2,30.7 21.2,31.25 21.5,31.55 21.5,33.5 22.2,34.2 22.2,39.3 v22.55,39.65 | v30.95,39.8 31.6,39.8 31.8,40 IC18.4
  Bottom 0.152: v22.55,39.65 30.8,39.65 v30.95,39.8
ENABLE_Y  (via drill 0.3)
  Top 0.152: IC2.22 36.25,29.55 35.15,30.65 v35.15,33.2 | v36,34.4 35.9,34.5 v35.9,39.45 | v45.05,39.65 45.3,39.65 45.95,40.3 IC20.4
  Bottom 0.152: v35.15,33.2 35.15,33.45 36,34.3 v36,34.4 | v35.9,39.45 44.85,39.45 v45.05,39.65
ENABLE_Z  (via drill 0.3)
  Top 0.152: IC5.22 49.75,29.6 48.25,31.1 v48.25,32.3 | v49.6,33.15 49.75,33.3 49.75,39.25 v50.25,39.75 | v57.9,40.4 58.1,40.6 IC21.4
  Bottom 0.152: v48.25,32.3 48.6,32.65 49.1,32.65 v49.6,33.15 | v50.25,39.75 57.25,39.75 v57.9,40.4
END_STOP_X_1
  Top 0.152: P9.25 56.18,60.32 57.15,59.35 57.15,54.85 56.75,54.45 56.75,50.15 57.35,49.55 57.35,48.31 U19.2
END_STOP_X_1_IN  (via drill 0.3)
  Top 0.15: v111.4,50.03 U8.4
  Top 0.152: v54.5,62.05 54.5,51.4 v54.55,51.35 | v58.75,51.1 58.75,48.29 U19.3 | v49.42,61.63 49.23,61.63 48.85,62 47.85,62 47.55,62.3 R61.1 47.55,64.14 X22.1
  Bottom 0.15: v58.75,51.1 65.1,51.1 65.92,50.28 70.3,50.28 71.33,51.3 84.33,51.3 85.35,50.28 90.35,50.28 93.03,47.6 104.75,47.6 108.25,51.1 110.55,51.1 v111.4,50.03
  Bottom 0.152: v54.55,51.35 58.5,51.35 v58.75,51.1 | v49.42,61.63 54.45,62 v54.5,62.05
END_STOP_X_2  (via drill 0.3)
  Top 0.152: v69.75,59.1 69.75,54.65 v69.8,54.6 | v63.8,54.6 63.8,53.19 U19.10
  Bottom 0.152: v69.75,59.1 69.85,59 72.3,59 P9.11 | v69.8,54.6 66.4,54.6 66.15,54.35 64.05,54.35 v63.8,54.6
END_STOP_X_2_IN  (via drill 0.3)
  Top 0.152: U19.9 v65.05,51.61 v65.05,51.6 | IC6.4 69.5,49.7 70.3,50.5 v70.3,51.35 70.9,51.95 70.9,56.15 72.4,57.65 72.4,60.8 72.1,61.1 R64.1 72.1,63.4 72.25,63.55 72.25,64.09 X10.1
  Bottom 0.152: v65.05,51.6 66.25,51.6 66.4,51.45 67.15,51.45 67.3,51.6 70.05,51.6 v70.3,51.35
END_STOP_Y_1
  Top 0.152: U19.4 60.15,48.42 60.15,49.05 60,49.2 60,50.35 60.6,50.95 60.6,55.4 59.4,56.6 59.4,59.3 P9.23
END_STOP_Y_1_IN
  Top 0.152: U19.5 61.23,50.59 61.9,51.25 61.9,55.25 59.8,57.35 59.8,59.45 59.65,59.6 59.65,61.31 58.86,62.1 55.8,62.1 55.6,62.3 R62.1 55.6,63.99 X1.1
END_STOP_Y_2  (via drill 0.3)
  Top 0.152: P9.28 53.3,51.6 v53.25,51.55 | v61.2,51.6 61.2,53.13 U19.12
  Bottom 0.152: v53.25,51.55 53.8,52.1 60.7,52.1 v61.2,51.6
END_STOP_Y_2_IN  (via drill 0.3)
  Top 0.152: v79.9,56.45 79.9,61.75 80.15,62 80.15,62.45 R65.1 80.1,63.05 80.5,63.45 80.75,63.45 80.9,63.6 X19.1 | v68.8,56.35 69.2,55.95 IC7.4 | U19.11 62.51,55.7 v62.4,55.8
  Bottom 0.152: v79.9,56.45 79.85,56.45 79.7,56.6 69.05,56.6 v68.8,56.35 68.55,56.1 62.7,56.1 v62.4,55.8
END_STOP_Z_1  (via drill 0.3)
  Top 0.152: U19.6 62.51,46.91 v62.45,46.85 | v72.2,47.65 72.15,47.65 71.7,48.1 71.7,55.9 72.35,56.55 74,56.55 74.85,57.4 74.85,61.2 v74.45,61.6
  Bottom 0.152: v62.45,46.85 62.55,46.85 63.4,47.7 72.15,47.7 v72.2,47.65 | v74.45,61.6 72.36,61.6 P9.13
END_STOP_Z_1_IN
  Top 0.152: U19.7 63.77,49.53 65.95,51.7 65.95,53.95 65,54.9 65,56.95 64.7,57.25 64.7,61.3 63.85,62.15 63.85,62.75 R63.1 63.75,63.99 X13.1
END_STOP_Z_2  (via drill 0.3)
  Top 0.152: U19.15 57.42,54.48 v57.7,54.75 | v65.8,55.05 65.8,57.59 P9.18
  Bottom 0.152: v57.7,54.75 62.95,54.75 63.45,55.25 65.6,55.25 v65.8,55.05
END_STOP_Z_2_IN  (via drill 0.3)
  Top 0.15: v107.5,55.03 107.92,55 108.4,54.53 U8.13
  Top 0.152: U19.14 58.7,54.15 59.25,54.7 59.25,55.8 v59.1,55.95 | X12.1 88.99,63.84 88.4,63.25 88.4,62.55 R66.1 v88.33,57.08 v88.33,56.98
  Bottom 0.15: v88.33,57.08 91.3,57.05 101.62,57.05 102.08,56.6 105.9,56.6 v107.5,55.03
  Bottom 0.152: v59.1,55.95 60.85,55.95 61.65,55.15 62.9,55.15 63.4,55.65 69.05,55.65 69.67,56.28 79.28,56.28 79.65,55.9 80.12,55.9 80.83,56.6 87.17,56.6 87.55,56.98 v88.33,56.98
FAN0  (via drill 0.3)
  Top 0.15: Q6.1 101.72,73.13 103.58,71.28 103.58,68.45 101.78,66.65 101.78,57.43 101.4,57.05 v101.4,56.43 | U11.13 20.62,55.03 v20.55,55.1
  Top 0.3: Q6.1 R34.2
  Bottom 0.15: v20.55,55.1 23.02,55.1 23.3,54.83 23.95,54.83 24.12,55 32.67,55 32.83,54.85 35.58,54.85 36.15,55.43 44.88,55.43 46.25,54.05 47.08,54.05 48.23,52.9 48.4,52.9 48.7,52.6 51.2,52.6 52.62,54.03 71.05,54.03 73.1,56.08 79.1,56.08 79.47,55.7 80.3,55.7 80.9,56.3 91.4,56.3 91.7,56.6 101.1,56.6 v101.4,56.43
FAN0_OUT  (via drill 0.3)
  Top 0.3: Q6.3 101.47,72.18 101.7,71.95 101.7,70.78 LED0.C v102.25,70.55 | U8.14 109.38,55.03 109.22,54.88 108.7,54.88 108.33,55.25 108.33,55.5 v108.25,55.58
  Bottom 0.3: v108.25,55.58 108.25,63.4 103.35,68.3 103.35,69.45 v102.25,70.55
FAN1  (via drill 0.3)
  Top 0.15: U11.15 19.98,49.01 v20.75,49.78 | v101.6,55.45 101.6,55.8 102.12,56.35 102.15,66.43 103.92,68.2 103.92,72.43 104.75,73.25 105.05,73.25 105.67,73.88 105.92,73.88 Q7.1
  Top 0.3: Q7.1 R33.2
  Bottom 0.15: v20.75,49.78 24.85,49.78 25.9,50.83 36.33,50.83 36.5,50.65 37.17,50.65 38.05,51.53 51.45,51.53 53.17,53.25 71.2,53.25 73.38,55.43 77.9,55.43 78.38,54.95 80.03,54.95 81.03,55.95 87.85,56 91.7,56 91.85,56.15 100.17,56.15 100.88,55.45 v101.6,55.45
FAN1_OUT  (via drill 0.3)
  Top 0.3: Q7.3 106.33,72.18 106.55,71.95 106.55,70.8 LED5.C 106.3,70.5 v107.1,70.5 | U8.15 108.94,55.54 v108.92,55.53
  Bottom 0.3: v108.92,55.53 108.92,63.75 106.83,65.85 106.83,68.18 107.78,69.13 107.78,69.83 v107.1,70.5
FAN2  (via drill 0.3)
  Top 0.152: U11.16 20.62,45.92 20,45.3 v20,44.85 | v17.15,44.85 17.15,44.3 17,44.15 17,32.25 16.6,31.85 16.6,29.75 17,29.35 17,19.05 16.5,18.55 16.5,16.3 v17.5,15.3 | v90.3,14.05 90.3,12.35 89.85,11.9 89.85,10.75 R32.2 91.2,10.7 91.35,10.55 Q4.1
  Bottom 0.152: v90.3,14.05 89.7,14.05 89.3,14.45 74.15,14.45 73.45,15.15 67.15,15.15 66.55,15.75 65.75,15.75 65.2,15.2 52.8,15.2 52.2,15.8 38.65,15.8 37.95,15.1 31.1,15.1 30.95,14.95 29.15,14.95 29,15.1 18.1,15.1 17.9,15.3 v17.5,15.3 | v20,44.85 v17.15,44.85
FAN3  (via drill 0.3)
  Top 0.152: v97.1,8.5 Q5.1 97.1,10.45 96.55,11 R5.2 | v17.15,13.55 15.8,14.9 15.8,19.15 16.3,19.65 16.3,20.4 16.2,20.5 16.2,29.1 15.8,29.5 15.8,32.2 16.25,32.65 16.25,44.35 16.05,44.55 16.05,46.65 v16.15,46.75 | v21.25,46.75 21.25,47.95 U11.17
  Bottom 0.15: 96.25,7.65 84.4,7.65 84.08,7.98 83.3,7.98 82.97,7.65 72.55,7.65
  Bottom 0.152: v97.1,8.5 96.25,7.65 | 72.55,7.65 72.35,7.45 64.25,7.45 63.95,7.75 22.95,7.75 v17.15,13.55 | v16.15,46.75 v21.25,46.75
FAULT_E  (via drill 0.3)
  Top 0.15: v59.67,11.15 59.55,11.28 59.55,12.8 59.52,12.8 58.02,14.3 58.02,24.48 58.38,24.83
  Top 0.152: R36.1 61.6,34 61.6,31.35 v61.95,31 62.35,30.6 IC12.20 | v59,25.9 58.67,25.9 58.38,25.6 58.38,24.83
  Bottom 0.15: 64.4,10.95 64.3,10.85 59.9,10.85 59.67,11.08 v59.67,11.15
  Bottom 0.152: v61.95,31 61.2,31 59,28.8 v59,25.9 | P8.18 65.94,9.41 64.4,10.95
FAULT_H  (via drill 0.3)
  Top 0.15: 71.47,15.48 71.47,13.18 72.2,12.45
  Top 0.152: R51.1 75.1,33.25 74.95,33.1 74.95,31.7 75.35,31.3 v75.35,30.65 75.4,30.6 IC15.20 | v71.65,26.2 71.53,26.2 70.95,25.63 70.95,20.4 71.47,19.88 71.47,15.48 | 72.2,12.45 72.2,11.15 v72.15,11.1
  Bottom 0.15: v71.65,26.2 71.65,28 74.3,30.65
  Bottom 0.152: v75.35,30.65 74.3,30.65 | v72.15,11.1 72.55,10.7 77.4,10.7 P8.8
FAULT_X  (via drill 0.3)
  Top 0.152: v77.9,15.55 77.4,15.05 77.4,10.65 P8.10 | IC1.20 22.15,30.55 v21.9,30.8 22.1,31 R54.1 | v17.5,16.55 17.4,16.65 17.4,30.45 v17.3,30.55
  Bottom 0.152: v17.3,30.55 21.65,30.55 v21.9,30.8 | v17.5,16.55 18.55,15.5 29.35,15.5 29.5,15.35 30.45,15.35 30.55,15.45 37.7,15.45 38.4,16.15 52.45,16.15 53.05,15.55 65,15.55 65.55,16.1 66.65,16.1 67.25,15.5 73.8,15.5 74.25,15.05 77.35,15.05 77.85,15.55 v77.9,15.55
FAULT_Y  (via drill 0.3)
  Top 0.15: 31.5,18.18 31.5,16.2 v31.7,16
  Top 0.152: IC2.20 36.15,30.55 35.8,30.9 v35.8,31.3 35.85,31.35 35.85,33.6 35.2,34.25 R24.1 | P8.9 76.1,12 v76.1,16.25 | v31.4,27.55 31.4,21.15 31.5,21.05 31.5,18.18
  Bottom 0.15: v31.7,16 33.2,16
  Bottom 0.152: v76.1,16.25 75.95,16.4 74.25,16.4 73.75,15.9 67.3,15.9 66.75,16.45 65.2,16.45 64.65,15.9 53.35,15.9 52.75,16.5 38.15,16.5 37.5,15.85 33.35,15.85 33.2,16 | v35.8,31.3 34.65,31.3 33.4,30.05 32.5,30.05 31.4,28.95 v31.4,27.55
FAULT_Z  (via drill 0.3)
  Top 0.152: 50.1,30.55 IC5.20 50.1,30.65 49.6,30.65 49.1,31.15 49.1,32.6 48.75,32.95 R28.1 49.3,33.95 49.4,34.05 49.4,40.15 47.9,41.65 47.9,47.15 50.1,49.35 50.1,50.55 v50.05,50.6 | v57.75,50.65 57.75,51.5 58.1,51.85 58.1,54.35 58.45,54.7 58.45,57.71 P9.24
  Bottom 0.152: v50.05,50.6 57.7,50.6 v57.75,50.65
GND  (via drill 0.3)  (2 unrouted)
  Top 0.152: IC1.12 v26.4,30.73 | IC1.24 23.73,28.55 v23.8,28.43 | v25.6,29.18 25.52,29.18 IC1.TP | IC5.TP 52.77,28.85 v53.1,28.53 | IC5.24 51.17,28.6 v51.25,28.53 | IC12.12 66.45,30.93 v66.55,30.83 | C83.2 66.75,52.1 v66.7,52.05
  Top 0.2: C59.2 12.43,33.68 12.8,34.05 13.43,34.05 R47.1
  Top 0.25: IC1.11 26.55,31.7 IC1.12 | IC1.36 26.75,26.05 IC1.35 v26.4,26.88 | IC2.36 40.25,25.9 IC2.35 40.25,26.68 v40.4,26.88 | IC2.24 36.83,28.48 v37.6,28.43 | IC12.12 66.45,31.75 IC12.11 | IC12.24 63.95,28.6 v63.95,28.48 | IC12.TP 65.7,28.85 v65.7,28.53 | IC15.35 79.7,25.95 IC15.36 | IC15.24 76.97,28.6 v77.05,28.53 | IC15.TP 78.58,28.85 v78.9,28.53 | IC15.11 79.85,31.75 IC15.12 79.7,30.88 v79.75,30.83 | IC2.11 40.4,31.7 IC2.12 | IC5.11 53.95,31.75 IC5.12 | v66.55,26.88 66.55,26.1 | IC12.36 66.55,25.95 66.55,26.1 | 66.55,26.1 IC12.35 | v53.95,26.88 53.8,26.88 IC5.35 53.8,25.95 IC5.36
  Top 0.254: 14.62,36.05 14.12,36.55 14.12,38.43 C58.2 | 13.38,56.05 C57.2 | 14.5,24.3 13.12,24.3
  Top 0.35: v39.45,28.43 39.4,28.8 IC2.TP | C74.2 59.05,28.45 59.6,29 C65.1
  other vias: 15.28,24.9 14.62,24.25 14.62,25.55 15.28,26.2 14.62,26.8 15.28,27.3 15.05,60.13 15.97,60.13 15,58.88 15.97,58.88 15,57.68 15.97,57.68 15.18,40.35 14.65,39.75 14.65,41.05 15.22,41.7 14.65,42.3 15.18,42.9 28.52,38.1 94.35,57.58 23.8,30.73 24.7,30.73 23.8,29.18 23.8,27.68 23.8,29.93 24.7,28.43 24.7,29.18 24.7,29.93 24.7,27.68 23.8,26.88 24.7,26.88 25.6,30.73 25.6,29.93 26.4,28.43 25.6,28.43 26.4,29.93 26.4,29.18 25.6,26.88 26.4,27.68 25.6,27.68 25.02,20.55 25.82,20.55 25.82,19.8 25.02,19.8 93.42,16.05 99.38,16 99.28,13.05 99.08,11 98.97,8.3 93.28,10.85 93.28,8.25 93.42,12.8 69.62,52.85 21.1,24.13 20.7,29.93 37.6,30.73 38.5,30.73 37.6,29.23 37.6,27.68 37.6,29.98 38.5,28.43 38.5,29.23 38.5,29.98 38.5,27.63 37.6,26.88 38.5,26.88 39.45,30.73 40.4,30.73 39.45,29.23 39.45,27.63 39.45,29.98 40.4,28.43 40.4,29.23 40.4,29.98 40.4,27.63 39.45,26.88 51.25,30.83 52.1,30.83 51.25,29.28 51.25,27.73 51.25,30.03 52.1,28.53 52.1,29.28 52.1,30.03 52.1,27.73 51.25,26.88 52.1,26.88 53.1,30.83 53.95,30.83 53.1,29.28 53.1,27.73 53.1,30.03 53.95,28.53 53.95,29.28 53.95,30.03 53.95,27.73 53.1,26.88 63.95,30.78 64.75,30.78 63.95,29.18 63.95,27.68 63.95,29.93 64.75,28.48 64.75,29.18 64.75,29.93 64.75,27.68 63.95,26.88 64.75,26.88 65.7,30.83 65.7,29.23 65.7,27.73 65.7,29.98 66.55,28.53 66.55,29.23 66.55,29.98 66.5,27.73 65.7,26.88 77.05,30.83 77.9,30.83 77.05,29.23 77.05,27.73 77.05,29.98 77.9,28.53 77.9,29.23 77.9,29.98 77.9,27.73 77.05,26.88 77.9,26.88 78.9,30.83 78.9,29.23 78.9,27.73 78.9,29.98 79.75,28.53 79.75,29.23 79.75,29.98 79.75,27.73 78.9,26.88 79.75,26.88 30.95,36.88 39.02,20.65 39.83,20.65 39.83,19.9 39.02,19.9 24.48,35.85 23.82,35.85 35.23,24.18 42.67,33.6 44.33,32.75 44.33,31.8 42.67,34.3 37.62,35.8 38.33,35.8 78.28,20.75 79.08,20.75 52.58,20.7 53.38,20.7 53.38,19.95 52.58,19.95 65.25,20.68 66.03,20.7 66.05,19.98 65.25,19.95 28.68,33.35 28.68,34.1 70.33,48.4 65.12,49.7 20.52,18.18 21.32,18.18 21.32,17.43 20.52,17.43 78,34.95 80.12,41.6 62.33,22.73 29.98,33.15 51.27,35.7 48.1,29.88 73.08,18.6 73.83,18.6 73.83,17.85 73.08,17.85 62.98,18.85 63.38,19.5 60.98,17.13 59.92,17.15 47.75,18.4 48.65,18.4 49.52,14.8 46.85,18.38 36.23,21.8 36.2,21 36.62,17.5 35.83,17.5 58.58,21.83 58.58,22.58 58.6,20.28 58.6,21.08 63.88,35.7 64.62,35.7 68.78,34.35 68.78,33.6 51.98,35.7 34.3,29.98 48.7,24.13 71.62,25.05 71.62,24.23 71.62,22.58 71.65,23.43 50.7,22.13 49.83,22.05 49.83,21.28 45.05,25.38 32.15,25.73 32.15,25 32.15,24.28 32.15,23.53 60.88,29.9 48.77,37.3 74.58,23.8 57.83,33.4 56.17,33.3 56.17,33.95 70.12,33.35 74.97,37.7 71.03,37.2 84.22,37.1 57.98,37.6 45.17,36.95 20.57,37.55 82.03,34.4 82.05,33.55 45.02,26.45 80.17,46.5 82.38,46.5 82.38,45.55 80.17,45.5 82.38,44.45 82.38,43.5 77.95,49.98 78.75,49.98 79.65,49.98 80.45,49.98 78.2,53.58 79,53.58 79.9,53.58 80.7,53.58 87.72,46.5 87.72,45.55 87.72,44.45 87.72,43.55 76.85,53.18 76.85,52.33 94.35,58.38 95.5,55.33 96.3,55.33 97.2,55.33 98,55.33 95.45,59.03 96.25,59.03 97.15,59.03 97.95,59.03 97.72,51.85 97.72,50.9 97.72,49.8 97.72,48.85 98.88,51.85 98.88,50.9 98.88,49.8 98.88,48.85 104.28,51.85 104.28,50.9 104.28,49.8 104.28,48.85 92.97,55.7 92.97,55.03 92.25,55.7 92.28,55.03 74.7,50.53 75.5,50.53 75.5,49.78 74.7,49.78 67.12,46.95 35.27,37.65 61.77,37.7 90.1,55.03 72.45,49.68 17.15,9.75 17.9,9.75 17.15,8.95 17.9,8.95 75.38,43.05 78.03,44.8 64.83,45.15 73.4,52.88 90.5,58.68 27.4,21.18 41.55,20.5 42.5,20.55 28.1,21.18 55.9,20.88 55.08,20.9 67.83,21.23 68.78,21.23 80.85,21.43 81.7,21.45 18.77,19.33
  pour Top (no thermals): 12.93,67.25 98.22,67.1 98.22,76.43 116.65,76.3 116.83,40.7 86.55,40.68 86.55,23.68 101.15,23.73 101.15,1.35 arc-90 99.95,0 14.38,0.05 14.38,22.55 12.88,22.55
  pour Bottom (isolate 0.152): 116.75,76.53 98.17,76.45 98.17,66.8 13.7,67.2 14,14.55 6,14.55 6,20.05 0,20.05 0,0.05 99.8,0 arc90 101.1,1.35 101.1,23.73 86.5,23.68 86.5,40.8 116.85,40.7
  pour Bottom (no thermals): 0.95,20.05 0.95,12 6.3,12.05 6.3,20.05
  pour GND (no thermals): -0.4,69.8 107.25,69.9 107.35,0.15 -0.3,0.05
HEATER_E  (via drill 0.3)
  Top 0.15: v21.93,49.25 21.93,53.81 U11.11
  Top 0.152: v14.3,32.7 14.28,32.73 R47.2 13.4,32.68 Q3.4 | v18.6,32.7 18.6,46.85 v19.15,47.4
  Top 0.2: 13.43,32.7 R47.2
  Bottom 0.152: v14.3,32.7 v18.6,32.7 | v19.15,47.4 20.98,49.23 v21.93,49.25
HEATER_E_OUT  (via drill 0.3, 1)  (2 unrouted)
  Top 0.25: U8.35 111.83,65.52 v111.83,65.5 | U8.34 112.35,65.04 v112.35,65 | U8.33 111.83,64.53 v111.83,64.55 | U8.32 112.38,64.02 v112.38,64 | U8.31 111.83,63.54 v111.83,63.5
  Top 0.35: D1.A C59.1
  Top 0.5: Q3.8 7.3,24.27 7.3,28.08 Q3.5 Q3.6 9.12,26.8 | Q3.8 7.6,24.35 7.8,24.35 7.8,28.05 7.7,28.05 7.7,26.81 Q3.6 | Q3.7 Q3.8 | Q3.TH 9.5,26.18 R55.1 9.5,22.93 LED3.C
  Top 2: D1.A 9.6,27.15 9.55,27.1 9.55,26.8 9.12,26.8 9.39,26.54 | 9.39,26.54 Q3.TH | X3.2 9.01,26.16 9.39,26.54
  Bottom 2: 4.03,26.13 4.03,24.18 6.58,21.63 13.85,21.63 15.68,19.8 15.3,8.3 17.1,5.48 18.02,5.5 | v18,1.88 v16.05,1.88 16.05,5.3 | 18.02,1.9 18.02,5.5 | 18,5.5 18.02,5.5
  other vias: 18.07,5.38 16.15,5.43
  pour VCC: 14.72,6.55 88.53,6.55 88.53,15.93 84.05,15.93 83.72,44.6 111.5,44.6 111.5,76.35 116.8,76.35 116.8,40.9 86.47,40.9 86.47,23.88 101.2,23.88 101.2,-0.07 14.75,-0.07
HEATER_H
  Top 0.152: 17.45,59.55 R48.2 17.55,59.5 | Q2.4 16.59,61.46 17.55,60.5 17.55,59.5 | 17.55,59.5 18.5,59.5 23.25,54.75 23.25,53.84 U11.9
HEATER_HBP  (via drill 0.3)
  Top 0.152: v13.1,49.35 13.1,46.3 R46.2 13.07,44.88 13.4,44.55 Q1.4 | 22.55,52.55 v22.55,50.7 22.55,53.8 U11.10
  Bottom 0.152: v13.1,49.35 18.6,49.35 19.95,50.7 v22.55,50.7
I2C2_SCL  (via drill 0.3)
  Top 0.152: U11.26 27.12,49.78 v27.15,49.8 | v62.25,49.8 62.25,50.85 63.15,51.75 63.15,55.95 62.15,56.95 62.15,59.02 P9.19 | U18.6 32.94,49.99 v32.95,50.05
  Bottom 0.152: v27.15,49.8 30.65,49.8 31.3,50.45 32.5,50.45 32.95,50 | 32.95,50 32.95,49.8 v62.25,49.8 | v32.95,50.05 32.95,50
I2C2_SDA  (via drill 0.3)
  Top 0.152: U11.27 27.78,49.18 v27.75,49.25 | v63.15,49.6 63.15,50.75 64.45,52.05 64.45,56.79 P9.20 | U18.5 31.67,49.88 v31.65,49.9
  Bottom 0.152: v27.75,49.25 27.8,49.15 27.85,49.1 31.65,49.1 | 31.65,49.1 62.65,49.1 v63.15,49.6 | v31.65,49.9 31.65,49.1
IREF_E
  Top 0.152: R35.2 60.5,37.05 60.5,37.3 60.1,37.7 C79.1 R60.1
IREF_E_RAW  (via drill 0.3)
  Top 0.152: v60,46 60,42.05 61.45,40.6 61.45,39.55 R60.2 | v23.85,45.7 23.85,47.3 U11.21
  Bottom 0.152: v60,46 54,46 53.25,46.75 39.25,46.75 38.55,46.05 26.3,46.05 25.7,45.45 24.1,45.45 v23.85,45.7
IREF_H
  Top 0.152: R50.2 73.65,36.7 C75.1 R31.1
IREF_H_RAW  (via drill 0.3)
  Top 0.152: U11.22 24.53,46.32 v24.45,46.2 | v72.5,45.45 73.55,44.4 73.55,41.9 74.1,41.35 74.45,41.35 74.95,40.85 R31.2
  Bottom 0.152: v24.45,46.2 24.8,45.85 25.5,45.85 26.15,46.5 38.35,46.5 39.1,47.25 53.3,47.25 54.2,46.35 59.05,46.35 59.45,46.75 60.55,46.75 61.15,46.15 71.8,46.15 v72.5,45.45
IREF_X
  Top 0.152: R49.2 19.5,37.35 19.45,37.4 C77.1 R41.1
IREF_X_RAW
  Top 0.152: U11.18 21.9,47.99 21.9,46.45 20.75,45.3 R41.2
IREF_Y
  Top 0.152: R6.2 C76.1 R37.1
IREF_Y_RAW  (via drill 0.3)
  Top 0.152: v33.95,44.95 33.95,41.8 34.9,40.85 R37.2 | v22.05,44.9 22.05,45.9 22.6,46.45 22.6,47.95 22.55,48 U11.19
  Bottom 0.152: v33.95,44.95 26.95,44.95 26.55,44.55 26,44.55 25.65,44.9 v22.05,44.9
IREF_Z
  Top 0.152: R27.2 C78.1 R58.1
IREF_Z_RAW  (via drill 0.3)
  Top 0.152: v23.25,49.2 23.25,48.6 U11.20 | R58.2 48.8,40.15 47.55,41.4 v47.55,48.5
  Bottom 0.152: v47.55,48.5 24.4,48.55 24.38,48.55 23.73,49.2 v23.25,49.2
N$1  (via drill 0.3)
  Top 0.152: v24.45,50.65 24.5,50.7 24.5,51.25 25.16,51.92 U11.6
  Bottom 0.152: SV2.1 17.49,48.4 18.55,48.4 20.5,50.35 21.75,50.35 21.95,50.15 23.95,50.15 v24.45,50.65
N$2  (via drill 0.3)
  Top 0.25: IC2.13 39.75,32.55 v39.85,32.65
  Top 0.5: v38.1,21.75 38.1,19.33 37.8,19.03 37.8,15.48 36.83,14.5 36.83,2.66 X15.3
  Bottom 0.5: v39.85,32.65 41,32.65 41.5,32.15 41.5,25.15 v38.1,21.75
N$3
  Top 0.152: C3.2 35.5,26.55 35.85,26.55 36,26.7 36,26.95 36.1,27.05 IC2.27
N$4
  Top 0.152: U1.7 26.93,37.38 27.15,37.15 28.7,37.15 29.05,37.55 IC4.1
N$5
  Top 0.152: U1.6 26.27,37.49 27,36.75 28.9,36.75 29.05,36.9 IC4.2
N$6
  Top 0.152: IC1.18 23.4,32.2 23.2,32.4 23.2,36.35 23.7,36.85 23.7,37.5 23.75,37.55 23.75,38.05 U1.2
N$8
  Top 0.152: R45.2 10.9,1.08 LED8.C
N$9
  Top 0.3: LED5.A R19.1
N$12
  Top 0.25: IC15.27 75.45,27.1 C9.2
N$13
  Top 0.25: IC15.14 78.7,33.4 78.75,33.45 R9.2
N$14
  Top 0.152: IC5.27 49.2,27.1 49.1,27 49.1,26.53 C7.2
N$15
  Top 0.25: IC5.14 52.8,33.75 53,33.95 R7.2
N$16
  Top 0.152: C1.1 20.38,26.63 20.25,26.15 20.25,25.9 20.4,25.75 21.95,25.75 IC1.28
N$17
  Top 0.152: IC1.27 22.4,27.05 22.1,26.75 21.72,26.75 C1.2
N$18
  Top 0.25: IC1.14 25.4,34.03 R1.2
N$19
  Top 0.25: IC1.33 25.4,24 25.45,23.95 R2.2
N$20
  Top 0.152: IC1.23 22.4,29.05 19.45,32 19.45,35.35 R49.1 C12.1
N$21
  Top 0.3: LED0.A R25.1
N$22  (via drill 0.3)
  Top 0.25: 38.6,25.2 38.6,25.25 38.75,25.4 IC2.32
  Top 0.5: 38.6,25.2 38.1,24.7 38.1,22.8 37.35,22.05 v37.35,20.35 | v41.35,17.35 41.35,15.58 41.85,15.08 41.85,5.05 42,4.9 X15.1
  Bottom 0.5: v41.35,17.35 40.38,17.35 37.38,20.35 v37.35,20.35
N$23
  Top 0.3: U6.7 R22.1 R12.2
N$24
  Top 0.25: IC5.33 52.8,24.1 R8.2
N$25  (via drill 0.3)
  Top 0.3: U6.5 76.1,48.1 79.2,48.1 D6.C | U6.5 76.1,47.6 | 76.1,47.6 76.1,47.4 79.2,47.4 79.2,47.6 76.1,47.6 | U6.5 76.1,47.85 76.2,47.85 | 76.2,47.85 76.75,47.85 | 76.75,47.85 v76.75,47.75 76.2,47.85 | 76.75,47.85 79.25,47.85 | 76.2,47.85 U6.5
  Top 0.5: C50.2 v73.65,45.3
  Top 1: D6.C 79.2,47.85 82.6,47.85 L1.P$2
  Bottom 0.5: v73.65,45.3 U6.5 v76.75,47.75 v77.75,47.75
N$26
  Top 0.152: 47.4,35.3 R27.1 C25.1 48.1,34.6 48.1,33.15 47.7,32.75 47.7,31.15 49.75,29.1 IC5.23
N$27
  Top 0.152: IC5.28 50.3,26.55 50.05,26.55 50.05,26.15 49.65,25.75 49.5,25.75 47.98,25.75 47.9,25.75 47.75,25.9 C7.1
N$28
  Top 0.152: IC5.3 56.45,27.6 58.35,29.5 58.35,30.1 58.75,30.5 58.75,34.35 58.8,34.4 IC10.4
N$29  (via drill 0.3)
  Top 0.25: v52.2,32.65 52.3,32.55 IC5.15
  Top 0.5: v47.2,30 47.15,29.95 46.45,29.95 45.92,29.43 45.92,29.28 44.3,27.65 44.3,17.58 46.05,15.83 46.05,13.43 46.95,12.53 46.95,6.23 47.97,5.21 X16.4
  Bottom 0.5: v47.2,30 49.05,31.85 52.2,31.85 v52.2,32.65
N$30
  Top 0.25: IC15.33 78.7,24.1 78.75,24.05 R10.2
N$31
  Top 0.152: IC1.25 22.45,28.05 21.5,29 C21.2 21.15,28.85 20.8,28.85 20.65,28.7 20.65,28.05 20.5,27.9 R53.1
N$32  (via drill 0.3)
  Top 0.25: 52.15,25.1 52.15,25.15 52.3,25.3 IC5.32
  Top 0.5: v51.75,19.35 51.75,24.7 52.15,25.1 | v55.02,17 54.58,16.55 54.58,6.88 55.59,5.87 X16.1
  Bottom 0.5: v51.75,19.35 54.1,17 v55.02,17
N$33
  Top 0.25: IC1.29 23.4,25.8 22.75,25.8 22,25.05 C22.1
N$34
  Top 0.152: IC3.2 29.7,34.65 28.65,35.7 26.6,35.7 25,37.25 25,38.1 U1.4
N$35
  Top 0.25: IC2.14 39.25,33.88 R3.2
N$36
  Top 0.25: IC2.33 39.25,24 R4.2
N$37  (via drill 0.3)
  Top 0.25: IC5.13 53.3,32.6 v53.4,32.7
  Top 0.5: v50.38,19.23 50.45,19.15 50.45,13.83 49.5,12.88 49.5,5.45 50.51,4.45 X16.3
  Bottom 0.5: v53.4,32.7 54.3,32.7 54.9,32.1 54.9,24.45 50.38,19.93 v50.38,19.23
N$38
  Top 0.152: IC2.23 36.15,29.05 34.5,30.7 34.5,32.1 34.15,32.45 34.15,34.85 C18.1 R6.1
N$40
  Top 0.152: U1.5 25.63,37.47 26.85,36.25 28.75,36.25 29.7,35.3 IC3.1
N$41
  Top 0.152: IC2.28 36.6,26.4 35.9,25.75 34.85,25.75 34.45,25.75 34.3,25.9 34.3,26.5 34.1,26.5 C3.1
N$42
  Top 0.152: IC2.3 43.45,27.55 45.4,29.5 45.4,33.25 IC8.4
N$43
  Top 0.152: U1.1 23.1,38.04 23.1,37 22.85,36.75 22.85,31.15 IC1.19
N$44
  Top 0.152: U1.3 24.34,37.42 26.55,35.2 28.5,35.2 29.4,34.3 29.4,30.85 30.2,30.05 30.2,29.6 29.05,28.45 28.1,28.45 28,28.55 IC1.5
N$45  (via drill 0.3)
  Top 0.25: v38.65,32.65 38.75,32.6 IC2.15
  Top 0.5: 33.8,31.2 v33.75,31.25 30.65,28.15 30.65,27.23 30.9,26.98 30.9,14.05 31.7,13.25 31.7,7.55 34.38,4.88 34.38,2.57 X15.4
  Bottom 0.5: v33.75,31.25 34.55,32.05 38.65,32.05 v38.65,32.65
N$46
  Top 0.25: 40.3,25 39.95,25 39.75,25.2 IC2.34
  Top 0.5: 40.3,25 40.8,24.5 40.8,18.88 39.38,17.45 39.38,5.18 39.48,5.08 X15.2
N$47
  Top 0.152: IC2.25 36.2,28.05 35.55,28.7 35.2,28.7 C33.2 34.8,28.9 34.3,28.9 34.25,28.85 34.25,28.45 34.25,28 34.15,27.9 R59.1
N$48
  Top 0.25: IC2.29 36.95,25.9 36.4,25.35 36.1,25.35 36.1,25.05 C35.1
N$49
  Top 0.152: IC2.4 41.85,28.05 41.95,27.95 43.25,27.95 44.95,29.65 44.95,33.25 45.1,33.4 45.1,36 45.4,36.3 IC9.4
N$50
  Top 0.25: 53.9,25.1 53.75,25.25 53.3,25.25 IC5.34
  Top 0.5: 53.9,25.1 54.3,24.7 54.3,19.7 51.95,17.35 51.95,6.8 53.05,5.71 X16.2
N$51
  Top 0.152: IC5.25 49.8,28.1 49.15,28.75 48.95,28.75 C37.2 48.15,29 48.1,28.95 48.1,28.15 47.85,27.9 R70.1
N$52
  Top 0.152: C38.1 49.6,25.05 50.4,25.85 50.7,25.85 IC5.29
N$53
  Top 0.152: U2.3 37.94,37.02 38.15,36.8 38.5,36.8 40.05,35.25 42.55,35.25 43.7,34.1 43.7,29 43.05,28.35 42,28.35 41.85,28.5 41.45,28.5 IC2.5
N$54
  Top 0.152: IC5.4 56.35,28.1 58,29.75 58,30.3 58.4,30.7 58.4,33.85 58.15,34.1 58.15,36.85 58.2,36.9 58.65,36.9 IC11.4
N$55
  Top 0.152: U3.3 51.48,37.42 53.25,35.65 55.7,35.65 56.5,34.85 56.5,34.45 57.25,33.7 57.25,29.5 56.2,28.45 55.55,28.45 55.4,28.6 IC5.5
N$56
  Top 0.152: IC2.18 37.25,32.25 37.05,32.45 37.05,36.7 37.3,36.95 37.3,37.9 U2.2
N$57
  Top 0.152: IC5.18 50.8,32.45 50.65,32.6 50.65,37.15 50.8,37.3 50.8,38.16 U3.2
N$58
  Top 0.152: U3.1 50.15,38.17 IC5.19
N$59
  Top 0.152: U3.7 54.08,37.28 54.25,37.1 55.25,37.1 56.4,38.25 IC11.1
N$60
  Top 0.3: C49.1 72.5,52.2 74.1,52.2 U6.10
N$61
  Top 0.152: U3.6 53.41,37.34 54,36.75 55.5,36.75 56.35,37.6 IC11.2
N$62
  Top 0.152: IC10.1 56.6,36.05 56.25,36.4 53.65,36.4 52.75,37.3 52.75,38.15 U3.5
N$63
  Top 0.152: IC10.2 56.5,35.4 55.85,36.05 53.35,36.05 52.1,37.3 52.1,38.16 U3.4
N$64
  Top 0.152: R57.1 8.75,55.8 10.25,55.8 C57.1
  Top 0.254: 10.38,56.05 LED1.C | 10.38,56.05 C57.1 | 10.38,56.05 10.38,57.78 8.62,57.78 Q2.8 8.5,57.55 7.62,57.8 | Q2.6 8.5,60.3 8.5,60.96 8.5,61.43 Q2.5 | Q2.TH 10.25,60.3 9.88,61.05 | 7.62,58.98 Q2.7 8.1,58.05 8.1,57.93 7.62,59.88
  Top 0.5: 7.62,59.88 7.62,58.2 7.9,58.2 7.9,60.19 Q2.6
  Top 0.813: 7.62,57.8 7.62,59.88